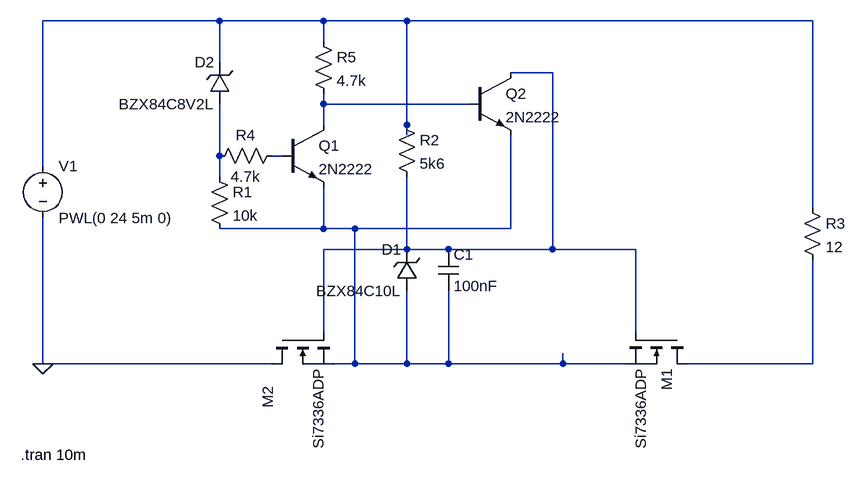
[diagram p0: schematic Rev1.2.asc]
Rev1.2.asc, the LTspice schematic file:
Version 4
SHEET 1 1096 680
WIRE 128 -128 -144 -128
WIRE 288 -128 128 -128
WIRE 416 -128 288 -128
WIRE 1040 -128 416 -128
WIRE 288 -96 288 -128
WIRE 128 -64 128 -128
WIRE 640 -48 576 -48
WIRE 288 0 288 -16
WIRE 512 0 288 0
WIRE 288 32 288 0
WIRE 416 32 416 -128
WIRE 416 48 416 32
WIRE 128 80 128 0
WIRE 224 80 208 80
WIRE -144 96 -144 -128
WIRE 128 112 128 80
WIRE 1040 160 1040 -128
WIRE 288 192 288 128
WIRE 288 192 128 192
WIRE 336 192 288 192
WIRE 576 192 576 48
WIRE 576 192 336 192
WIRE 416 224 416 112
WIRE 416 224 288 224
WIRE 480 224 416 224
WIRE 640 224 640 -48
WIRE 640 224 480 224
WIRE 768 224 640 224
WIRE 288 352 288 224
WIRE 768 352 768 224
WIRE -144 400 -144 176
WIRE 208 400 -144 400
WIRE 336 400 336 192
WIRE 336 400 304 400
WIRE 416 400 416 288
WIRE 416 400 336 400
WIRE 480 400 480 288
WIRE 480 400 416 400
WIRE 656 400 656 384
WIRE 656 400 480 400
WIRE 752 400 656 400
WIRE 1040 400 1040 240
WIRE 1040 400 848 400
FLAG -144 400 0
SYMBOL nmos 848 352 R90
SYMATTR InstName M1
SYMATTR Value Si7336ADP
SYMBOL nmos 208 352 M90
WINDOW 0 83 -6 Left 2
SYMATTR InstName M2
SYMATTR Value Si7336ADP
SYMBOL voltage -144 80 R0
WINDOW 123 0 0 Left 2
WINDOW 39 0 0 Left 2
SYMATTR InstName V1
SYMATTR Value PWL(0 24 5m 0)
SYMBOL res 400 16 R0
SYMATTR InstName R2
SYMATTR Value 5k6
SYMBOL cap 464 224 R0
SYMATTR InstName C1
SYMATTR Value 100nF
SYMBOL res 1024 144 R0
SYMATTR InstName R3
SYMATTR Value 12
SYMBOL zener 432 288 R180
WINDOW 0 24 64 Left 2
WINDOW 3 24 0 Left 2
SYMATTR InstName D1
SYMATTR Value BZX84C10L
SYMBOL zener 144 0 R180
WINDOW 0 24 64 Left 2
WINDOW 3 24 0 Left 2
SYMATTR InstName D2
SYMATTR Value BZX84C8V2L
SYMBOL res 112 96 R0
SYMATTR InstName R1
SYMATTR Value 10k
SYMBOL npn 224 32 R0
SYMATTR InstName Q1
SYMATTR Value 2N2222
SYMBOL res 224 64 R90
WINDOW 0 0 56 VBottom 2
WINDOW 3 32 56 VTop 2
SYMATTR InstName R4
SYMATTR Value 4.7k
SYMBOL res 272 -112 R0
SYMATTR InstName R5
SYMATTR Value 4.7k
SYMBOL npn 512 -48 R0
SYMATTR InstName Q2
SYMATTR Value 2N2222
TEXT -178 540 Left 2 !.tran 10m

The netlist it stands for:
* Rev1.2.asc
M1 N007 N002 N006 N006 Si7336ADP
M2 0 N002 N006 N006 Si7336ADP
V1 N001 0 PWL(0 24 5m 0)
R2 N001 N002 5k6
C1 N002 N006 100nF
R3 N001 N007 12
D1 N006 N002 BZX84C10L
D2 N004 N001 BZX84C8V2L
R1 N004 N006 10k
Q1 N003 N005 N006 0 2N2222
R4 N005 N004 4.7k
R5 N001 N003 4.7k
Q2 N002 N003 N006 0 2N2222
.model D D
.lib standard.dio
.model NPN NPN
.model PNP PNP
.lib standard.bjt
.model NMOS NMOS
.model PMOS PMOS
.lib standard.mos
.tran 10m
.backanno
.end